# EAGLE design SAML10_DEV (EAGLE 9.5.1)
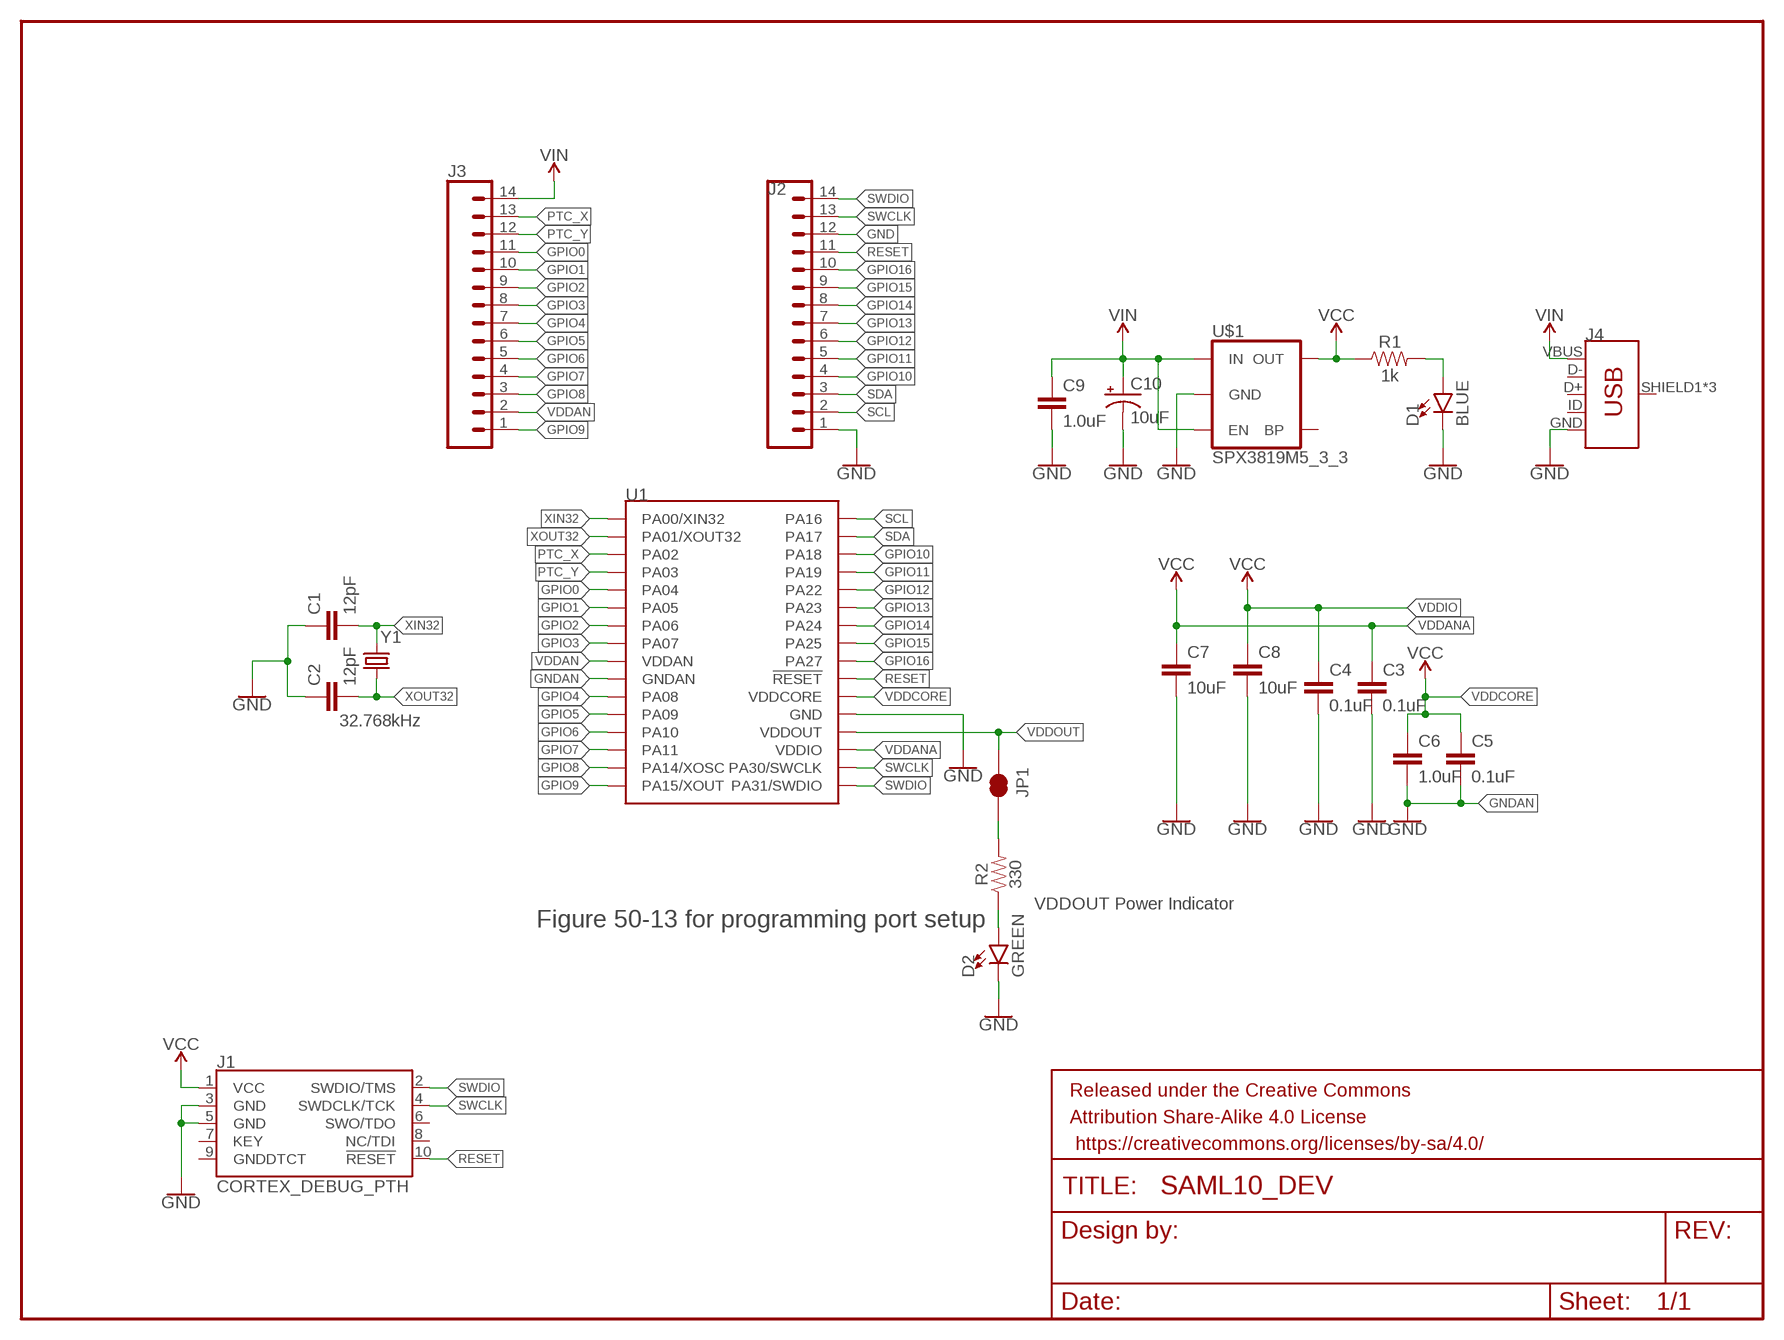
[diagram p0: schematic, sheet 1]

## Parts
C1  12pF  12PF-0603-50V-5%  [0603]
C2  12pF  12PF-0603-50V-5%  [0603]
C3  0.1uF  0.1UF-0402-16V-10%  [0402]
C4  0.1uF  0.1UF-0402-16V-10%  [0402]
C5  0.1uF  0.1UF-0402-16V-10%  [0402]
C6  1.0uF  1.0UF-0402-16V-10%  [0402]
C7  10uF  10UF-0603-6.3V-20%  [0603]
C8  10uF  10UF-0603-6.3V-20%  [0603]
C9  1.0uF  1.0UF-0402-16V-10%  [0402]
C10  10uF  10UF-POLAR-0603-6.3V-20%(TANT)  [0603-POLAR]
D1  BLUE  LED-BLUE0603  [LED-0603]
D2  GREEN  LED-GREEN0603  [LED-0603]
FRAME1  FRAME-LETTERNO_PACKAGE  [DUMMY]
J1  CORTEX_DEBUG_PTH  [2X5-PTH-1.27MM]
J2  CONN_14  [1X14]
J3  CONN_14  [1X14]
J4  USB_MICRO-BREDUCED_PASTE  [USB-B-MICRO-SMD_RED_PASTE]
JP1  JUMPER-SMT_2_NC_TRACE_NO-SILK  [SMT-JUMPER_2_NC_TRACE_NO-SILK]
R1  1k  1KOHM-0603-1/10W-1%  [0603]
R2  330  330OHM-0603-1/10W-1%  [0603]
U1  SAML10  [ATSAML10E15A-MU-ND]
U$1  SPX3819M5_3_3  V_REG_SPX3819-SOT23-5  [SOT23-5]
Y1  32.768kHz  CRYSTAL-32.768KHZSMD-3.2X1.5  [CRYSTAL-SMD-3.2X1.5MM]

## Nets
GND: C1.1 C2.1 C3.2 C4.2 C7.2 C8.2 C9.2 C10.- D1.C D2.C J1.3(GND) J1.5(GND) J2.1 J2.12 J4.GND U1.P$28(GND) U$1.2(GND)
GNDAN: C5.2 C6.2 U1.P$10(GNDAN) ; supply symbol labelled GND
GPIO0: J3.11 U1.P$5(PA04)
GPIO1: J3.10 U1.P$6(PA05)
GPIO2: J3.9 U1.P$7(PA06)
GPIO3: J3.8 U1.P$8(PA07)
GPIO4: J3.7 U1.P$11(PA08)
GPIO5: J3.6 U1.P$12(PA09)
GPIO6: J3.5 U1.P$13(PA10)
GPIO7: J3.4 U1.P$14(PA11)
GPIO8: J3.3 U1.P$15(PA14/XOSC)
GPIO9: J3.1 U1.P$16(PA15/XOUT)
GPIO10: J2.4 U1.P$19(PA18)
GPIO11: J2.5 U1.P$20(PA19)
GPIO12: J2.6 U1.P$21(PA22)
GPIO13: J2.7 U1.P$22(PA23)
GPIO14: J2.8 U1.P$23(PA24)
GPIO15: J2.9 U1.P$24(PA25)
GPIO16: J2.10 U1.P$25(PA27)
N$1: JP1.2 R2.2
N$2: D2.A R2.1
N$25: D1.A R1.2
PTC_X: J3.13 U1.P$3(PA02)
PTC_Y: J3.12 U1.P$4(PA03)
RESET: J1.10(!RESET) J2.11 U1.P$26(!RESET)
SCL: J2.2 U1.P$17(PA16)
SDA: J2.3 U1.P$18(PA17)
SWCLK: J1.4(SWDCLK/TCK) J2.13 U1.P$31(PA30/SWCLK)
SWDIO: J1.2(SWDIO/TMS) J2.14 U1.P$32(PA31/SWDIO)
VCC: J1.1(VCC) R1.1 U$1.5(OUT)
VDDAN: J3.2 U1.P$9(VDDAN)
VDDANA: C3.1 C7.1 U1.P$30(VDDIO) ; supply symbol labelled VCC
VDDCORE: C5.1 C6.1 U1.P$27(VDDCORE) ; supply symbol labelled VCC
VDDIO: C4.1 C8.1 ; supply symbol labelled VCC
VDDOUT: JP1.1 U1.P$29(VDDOUT)
VIN: C9.1 C10.+ J3.14 J4.VBUS U$1.1(IN) U$1.3(EN)
XIN32: C1.2 U1.P$1(PA00/XIN32) Y1.P$1
XOUT32: C2.2 U1.P$2(PA01/XOUT32) Y1.P$2
Unconnected: J1.6(SWO/TDO) J1.7(KEY) J1.8(NC/TDI) J1.9(GNDDTCT) J4.D+ J4.D- J4.ID J4.SHIELD1(SHIELD) J4.SHIELD2(SHIELD) J4.SHIELD3(SHIELD) U$1.4(BP)

## Notes on the sheet
- VDDOUT Power Indicator
- Figure 50-13 for programming port setup

## Library data of the parts
C1 C2 = SparkFun-Capacitors:12PF: 12pF ceramic capacitors A capacitor is a passive two-terminal electrical component used to store electrical energy temporarily in an electric field.; PROD_ID: CAP-09137
C3-C5 = SparkFun-Capacitors:0.1UF: 0.1µF ceramic capacitors A capacitor is a passive two-terminal electrical component used to store electrical energy temporarily in an electric field.; PROD_ID: CAP-12416
C6 C9 = SparkFun-Capacitors:1.0UF: 1µF ceramic capacitors A capacitor is a passive two-terminal electrical component used to store electrical energy temporarily in an electric field.; PROD_ID: CAP-12417
C7 C8 = SparkFun-Capacitors:10UF: 10.0µF ceramic capacitors A capacitor is a passive two-terminal electrical component used to store electrical energy temporarily in an electric field.; PROD_ID: CAP-11015
C10 = SparkFun-Capacitors:10UF-POLAR: 10.0µF polarized capacitors A capacitor is a passive two-terminal electrical component used to store electrical energy temporarily in an electric field.; PROD_ID: CAP-13210
D1 = SparkFun-LED:LED-BLUE: Blue SMD LED Used in manufacturing of various products at SparkFun Packages: 0603 - SMD 0603 package [Product Link] <http://www.digikey.com/product-detail/en/SMLE12BC7TT86/511-1589-2-ND/1641808> 1206 - SMD1206 package [Product Link] <http://www.digikey.com/product-detail/en/lite-on-inc/LTST-C150TBKT/160-1643-1-ND/573584> SparkFun Products: ESP8266 Thing-Dev Board <https://www.sparkfun.com/products/13711> RedBoard <https://www.sparkfun.com/products/12757>; PROD_ID: DIO-08575
D2 = SparkFun-LED:LED-GREEN: Green SMD LED Used in manufacturing of various products at SparkFun Packages: 0603 - SMD 0603 package [Product Link] <http://www.futureelectronics.com/en/technologies/semiconductors/optoelectronics/leds/Pages/9894312-LTST-C190GKT.aspx?CrossPart=HSMG-C190&IM=0> LilyPad 1206 - SMD1206 LilyPad package [Product Link] <http://www.futureelectronics.com/en/Technologies/Product.aspx?ProductID=IN150NGHARVATEKCORPORATION2049943&IM=0> 1206 - SMD1206 package [Product Link] <http://www.futureelectronics.com/en/technologies/semiconductors/optoelectronics/leds/Pages/8315665-LTST-C150KGKT.aspx?IM=0> 1206 Bottom Mount -SMD 1206 Bottom Mount [Product Link] <http://www.digikey.com/product-detail/en/lite-on-inc/LTST-C230KGKT/160-1456-1-ND/386854> SparkFun Products: Pro Mini 328 -5V <https://www.sparkfun.com/products/821> RedBoard <https://www.sparkfun.com/products/12757> MP3 Trigger <https://www.sparkfun.com/products/13720> Makey Makey <https://www.sparkfun.com/products/11076>; PROD_ID: DIO-00821
FRAME1 = SparkFun-Aesthetics:FRAME-LETTER: Schematic Frame - Letter Standard 8.5x11 US Letter frame; DESIGNER: Nobody; VERSION: v01
J1 = SparkFun-Connectors:CORTEX_DEBUG: Cortex Debug Connector - 10 pin Supports JTAG debug, Serial Wire debug, and Serial Wire Viewer. PTH and SMD connector options available. General Connector Information <http://infocenter.arm.com/help/topic/com.arm.doc.faqs/attached/13634/cortex_debug_connectors.pdf> Products: PTH Connector <http://www.digikey.com/product-detail/en/cnc-tech/3220-10-0100-00/1175-1627-ND/3883661> -via Digi-Key SparkFun PSoc <https://www.sparkfun.com/products/13229> SparkFun T <https://www.sparkfun.com/products/13810>
J2 J3 = SparkFun-Connectors:CONN_14: Multi connection point. Often used as Generic Header-pin footprint for 0.1 inch spaced/style header connections On any of the 0.1 inch spaced packages, you can populate with these: Break Away Headers - Straight <https://www.sparkfun.com/products/116> (PRT-00116) Break Away Male Headers - Right Angle <https://www.sparkfun.com/products/553> (PRT-00553) Female Headers <https://www.sparkfun.com/products/115> (PRT-00115) Break Away Headers - Machine Pin <https://www.sparkfun.com/products/117> (PRT-00117) Break Away Female Headers - Swiss Machine Pin <https://www.sparkfun.com/products/743> (PRT-00743) For SCREWTERMINALS and SPRING TERMINALS visit here: Screw Terimnals on SparkFun.com <https://www.sparkfun.com/search/results?term=Screw+Terminals> (5mm/3.5mm/2.54mm spacing) This device is also useful as a general connection point to wire up your design to another part of your project. Our various solder wires solder well into these plated through hole pads. Hook-Up Wire - Assortment (Stranded, 22 AWG) <https://www.sparkfun.com/products/11375> (PRT-11375) Hook-Up Wire - Assortment (Solid Core, 22 AWG) <https://www.sparkfun.com/products/11367> (PRT-11367) View the entire wire category on our website here <https://www.sparkfun.com/categories/141> Special notes: Molex polarized connector foot print use with SKU : PRT-08231 with associated crimp pins and housings. 1MM SMD Version SKU: PRT-10208 NOTES ON THE VARIANTS LOCK and LOCK_LONGPADS... This footprint was designed to help hold the alignment of a through-hole component (i.e. 6-pin header) while soldering it into place. You may notice that each hole has been shifted either up or down by 0.005 of an inch from it's more standard position (which is a perfectly straight line). This slight alteration caused the pins (the squares in the middle) to touch the edges of the holes. Because they are alternating, it causes a "brace" to hold the component in place. 0.005 has proven to be the perfect amount of "off-center" position when using our standard breakaway headers. Although looks a little odd when you look at the bare footprint, once you have a header in there, the alteration is very hard to notice. Also,if you push a header all the way into place, it is covered up entirely on the bottom side.
J4 = SparkFun-Connectors:USB_MICRO-B: USB Type Micro-B Connector Male/female and PTH/SMT variants SparkFun Products: SparkFun microB USB Breakout <https://www.sparkfun.com/products/12035> SparkFun USB microB Plug Breakout <https://www.sparkfun.com/products/10031> SparkFun ESP8266 Thing <https://www.sparkfun.com/products/13231>; PROD_ID: CONN-11752
JP1 = SparkFun-Jumpers:JUMPER-SMT_2_NC_TRACE: Normally closed trace jumper This jumper has a trace between two pads so it's normally closed (NC). Use a razor knife to open the connection. For best results follow the IPC guidelines for cutting traces: Cutout at least 0.063 mm (0.005 in). Remove all loose material to clean up the cut area. Seal the cut with an approved epoxy. Reapply solder to reclose the connection.
R1 = SparkFun-Resistors:1KOHM: 1kΩ resistor A resistor is a passive two-terminal electrical component that implements electrical resistance as a circuit element. Resistors act to reduce current flow, and, at the same time, act to lower voltage levels within circuits. - Wikipedia; PROD_ID: RES-07856
R2 = SparkFun-Resistors:330OHM: 330Ω resistor A resistor is a passive two-terminal electrical component that implements electrical resistance as a circuit element. Resistors act to reduce current flow, and, at the same time, act to lower voltage levels within circuits. - Wikipedia; PROD_ID: RES-00818
U1 = ARM_Cortex_23:SAML10
U$1 = SparkFun-IC-Power:V_REG_SPX3819: SPX3819 Voltage Regulator 3.3V 500mA, 16V input Datasheet <https://www.exar.com/content/document.ashx?id=22106> SparkFun Products: SparkFun Serial Controlled Motor Driver <https://www.sparkfun.com/products/13911>; PROD_ID: VREG-13321
Y1 = SparkFun-Clocks:CRYSTAL-32.768KHZ: 32.768kHz Crystal Frequency: 32.768kHz Frequency Stability: ±20ppm Load Capacitance: 12.5pF (PTH-2X6 & SMD-3.2X1.5), 6pF (SMD-2X6) SparkFun Products: SparkFun BigTime Watch Kit <https://www.sparkfun.com/products/11734> SparkFun nRF52832 Breakout <https://www.sparkfun.com/products/13990> SparkFun Real Time Clock Module <https://www.sparkfun.com/products/12708>; PROD_ID: XTAL-13062

## Board
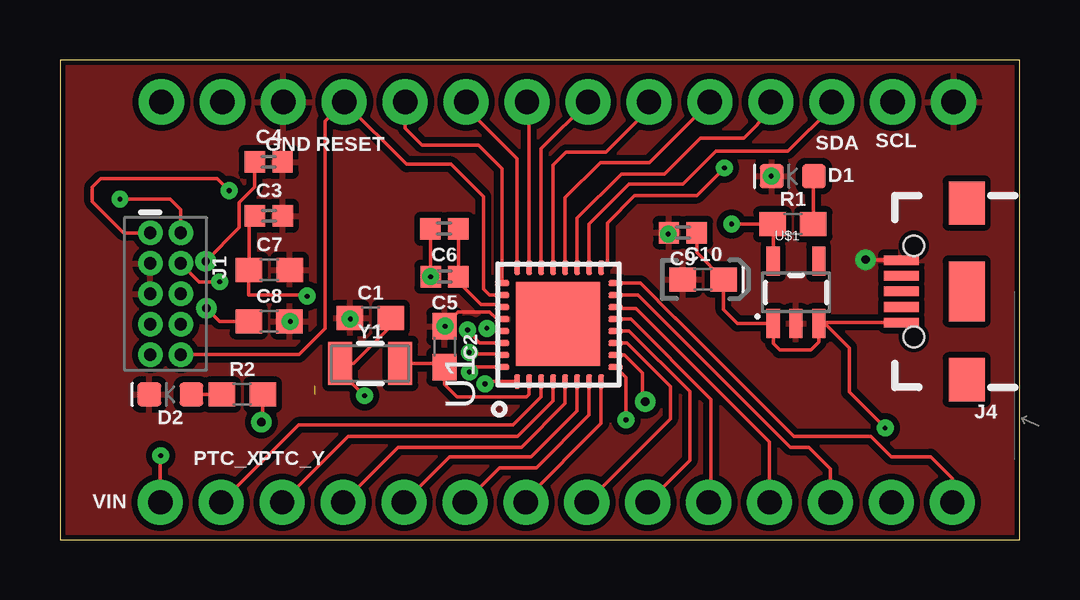
[diagram p1: board, top side]
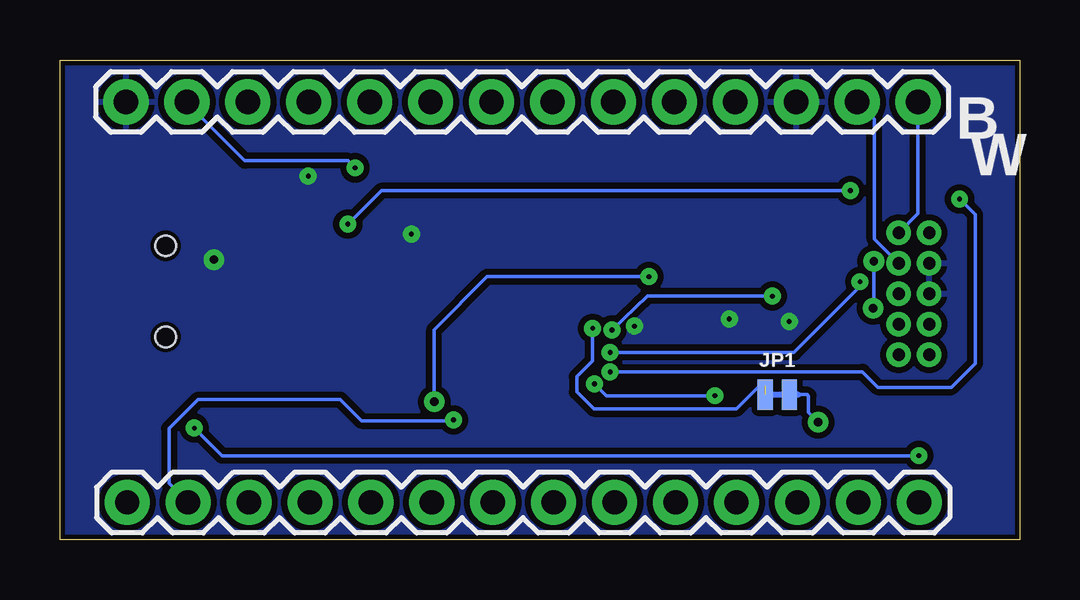
[diagram p2: board, bottom side, seen from below]

Size 40 x 20 mm. Coordinates in mm from the lower left corner, seen from the top.
Outline: 0,0 40,0 40,20 0,20 0,0
Copper layers (1*16): Top 0.035mm / dielectric 1.5mm / Bottom 0.035mm
Design rules "SparkFun-2-layer-STANDARD": minimum track width 10mil, minimum drill 20mil, track to track 10mil, track to pad 8mil, pad to pad 8mil, via to via 10mil, smd to smd 8mil, copper to edge 8mil, drill to drill 8mil, minimum pad ring 10mil, minimum via ring 10mil, stop-mask expansion 4mil, vias tented up to drill 25mil, thermal gap 10mil

### Footprints (pad centres in the part's own frame; a part is rotated, then mirrored left to right if it is on the bottom)
0603 = smd 1.1 x 1: 1 -0.85,0; 2 0.85,0
0402 = smd 0.85 x 0.9: 1 -0.58,0; 2 0.58,0
0603-POLAR = smd 1.1 x 1: + 0.85,0; - -0.85,0
LED-0603 = smd 1 x 1: A -0.877,0; C 0.877,0
2X5-PTH-1.27MM = drill 0.508 pad 1: 1 -2.54,-0.635; 2 -2.54,0.635; 3 -1.27,-0.635; 4 -1.27,0.635; 5 0,-0.635; 6 0,0.635; 7 1.27,-0.635; 8 1.27,0.635; 9 2.54,-0.635; 10 2.54,0.635
1X14 = drill 1.016 pad 1.88: 1 0,0; 2 2.54,0; 3 5.08,0; 4 7.62,0; 5 10.16,0; 6 12.7,0; 7 15.24,0; 8 17.78,0; 9 20.32,0; 10 22.86,0; 11 25.4,0; 12 27.94,0; 13 30.48,0; 14 33.02,0
USB-B-MICRO-SMD_RED_PASTE = smd 1.45 x 0.4: D+ 2.725,0; D- 2.725,0.65; GND 2.725,-1.3; ID 2.725,-0.65; VBUS 2.725,1.3 | smd 1.5 x 1.8: SHIELD1 0,3.685; SHIELD2 0,-3.685 | smd 1.5 x 2.5: SHIELD3 0,0 | hole 0.85: 2.2,1.9; 2.2,-1.9
SMT-JUMPER_2_NC_TRACE_NO-SILK = smd 0.635 x 1.27: 1 -0.508,0; 2 0.508,0
ATSAML10E15A-MU-ND = smd 0.6 x 0.25: P$1 0.15,4.25; P$2 0.15,3.75; P$3 0.15,3.25; P$4 0.15,2.75; P$5 0.15,2.25; P$6 0.15,1.75; P$7 0.15,1.25; P$8 0.15,0.75; P$17 4.9,0.75; P$18 4.9,1.25; P$19 4.9,1.75; P$20 4.9,2.25; P$21 4.9,2.75; P$22 4.9,3.25; P$23 4.9,3.75; P$24 4.9,4.25 | smd 0.25 x 0.6: P$9 0.75,0.15; P$10 1.25,0.15; P$11 1.75,0.15; P$12 2.25,0.15; P$13 2.75,0.15; P$14 3.25,0.15; P$15 3.75,0.15; P$16 4.25,0.15; P$25 4.25,4.88; P$26 3.75,4.88; P$27 3.25,4.88; P$28 2.75,4.88; P$29 2.25,4.88; P$30 1.75,4.88; P$31 1.25,4.88; P$32 0.75,4.88 | smd 3.5 x 3.5: P$33 2.54,2.54
SOT23-5 = smd 0.55 x 1.2: 1 -0.95,-1.3; 2 0,-1.3; 3 0.95,-1.3; 4 0.95,1.3; 5 -0.95,1.3
CRYSTAL-SMD-3.2X1.5MM = smd 1 x 1.8: P$1 -1.25,0; P$2 1.25,0

### Placement (x,y rotation side)
C1  12.94,9.24 0 top
C2  16.03,8.04 270 top
C3  8.71,13.5 0 top
C4  8.7,15.75 0 top
C5  16.03,10.96 180 top
C6  16.02,12.96 180 top
C7  8.73,11.25 0 top
C8  8.72,9.1 0 top
C9  25.96,12.8 180 top
C10  26.81,10.85 0 top
D1  30.55,15.15 180 top
D2  4.6,6.05 180 top
FRAME1  0.02,0.01 0 top
J1  4.4,10.25 270 top
J2  37.25,18.25 0 bottom
J3  37.2,1.55 0 bottom
J4  37.8,10.35 180 top
JP1  10.1,6.05 0 bottom
R1  30.55,13.15 0 top
R2  7.6,6.05 0 top
U1  23.31,6.44 90 top
U$1  30.68,10.31 0 top
Y1  12.93,7.34 0 top

### Tracks (layer width: path | path; a pad name or v marks a point on that pad's centre or on a via)
GND  (via drill 0.2, 0.35)
  Top 0.152: J4.GND 33.65,11.65 33.6,11.7 v33.58,11.68 | v16.05,8.9 16.05,8.95 16.59,9.49 17.91,9.49 18.21,9.19 U1.P$28
  other vias: 29.65,15.15 25.35,12.74 9.6,9.1 12.1,9.2
  pour Top: 0,20 0,0 40,0 40,20
  pour Bottom: 0,20 0,0 40,0 40,20
GNDAN  (via drill 0.2, 0.35)
  Top 0.152: C6.2 C5.2 | U1.P$10 23.54,7.69 24.27,6.95 24.27,5.87 v24.4,5.74
  Bottom 0.152: v24.4,5.74 24.4,8.75 22.19,10.96 C5.2
  other vias: 15.45,10.96
GPIO0
  Top 0.152: U1.P$5 21.06,5.67 19.24,3.85 14.1,3.85 J3.11
GPIO1
  Top 0.152: U1.P$6 21.56,5.37 19.64,3.45 16.24,3.45 J3.10
GPIO2
  Top 0.152: U1.P$7 22.06,5.2 19.86,3 18.33,3 J3.9
GPIO3
  Top 0.152: U1.P$8 22.56,4.85 19.42,1.71 J3.8
GPIO4
  Top 0.152: U1.P$11 23.65,8.19 25.45,6.39 25.45,5.04 J3.7
GPIO5
  Top 0.152: U1.P$12 23.73,8.69 26.25,6.17 26.25,3.3 J3.6
GPIO6
  Top 0.152: J3.5 27.14,1.65 27.14,5.85 23.8,9.19 U1.P$13
GPIO7
  Top 0.152: J3.4 29.58,4.07 24.02,9.63 23.22,9.63 U1.P$14
GPIO8
  Top 0.152: U1.P$15 24.1,10.19 30.45,3.85 31.23,3.85 32.12,2.95 J3.3
GPIO9
  Top 0.152: U1.P$16 24.19,10.69 25.66,9.22 25.66,9.24 30.6,4.3 33.8,4.3 34.65,3.45 36.3,3.45 37.2,2.55 J3.1
GPIO10
  Top 0.152: U1.P$19 21.56,13.4 23.41,15.25 25.2,15.25 26.7,16.75 28.5,16.75 29.63,17.88 J2.4
GPIO11
  Top 0.152: U1.P$20 21.06,14.26 22.53,15.73 24.57,15.73 J2.5
GPIO12
  Top 0.152: U1.P$21 20.56,15.61 21.1,16.15 22.75,16.15 24.55,17.95 J2.6
GPIO13
  Top 0.152: U1.P$22 20.06,16.3 J2.7
GPIO14
  Top 0.152: U1.P$23 19.56,18.16 J2.8
GPIO15
  Top 0.152: U1.P$24 19.06,15.89 16.93,18.02 J2.9
GPIO16
  Top 0.152: U1.P$25 18.43,15.47 17.45,16.45 15.1,16.45 14.39,17.16 J2.10
N$1  (via drill 0.35)
  Top 0.152: R2.2 8.45,4.95 v8.4,4.9
  Bottom 0.152: v8.4,4.9 8.8,5.3 8.8,6 8.85,6.05 9.24,6.05
  Bottom 0.254: 9.24,6.05 JP1.2
N$2
  Top 0.152: D2.A R2.1
N$25
  Top 0.152: R1.2 31.4,15.12 D1.A
PTC_X
  Top 0.152: U1.P$3 20.06,5.95 18.89,4.78 9.95,4.78 J3.13
PTC_Y
  Top 0.152: U1.P$4 20.56,5.78 19.08,4.3 12.01,4.3 J3.12
RESET
  Top 0.152: U1.P$26 17.9,10.2 17.65,10.45 17.65,14.3 16.3,15.65 14.45,15.65 J2.11 11.05,17.45 11.05,8.8 9.96,7.71 J1.10
SCL  (via drill 0.2)
  Top 0.152: U1.P$17 22.81,11.59 22.81,13.2 23.96,14.35 26.55,14.35 v27.7,15.5
  Bottom 0.152: v27.7,15.5 28,15.8 32.3,15.8 34.71,18.21 J2.2
SDA
  Top 0.152: U1.P$18 22.06,13.15 23.73,14.82 25.2,14.82 25.97,14.82 27.35,16.2 30.35,16.2 32.17,18.02 J2.3
SWCLK  (via drill 0.2)
  Top 0.152: J1.4 5.8,10.75 v6.65,10.75 | U1.P$31 18.39,7.73 17.35,7.73 17.29,7.8 v17.06,7.8
  Bottom 0.152: J1.4 6.05,12.54 6.05,17.53 J2.13 | v6.65,10.75 6.65,10.55 9.4,7.8 v17.06,7.8
SWDIO  (via drill 0.2)
  Top 0.152: v2.5,14.2 4.6,14.2 5.04,13.77 J1.2 | U1.P$32 17.06,7.19 v17.06,6.99
  Bottom 0.152: J1.2 4.23,13.6 J2.14 | v17.06,6.99 6.54,6.99 5.9,6.35 2.85,6.35 1.85,7.35 1.85,13.55 v2.5,14.2
VCC  (via drill 0.2)
  Top 0.152: U$1.5 29.73,13.12 R1.1 v28,13.15 | J1.1 2.66,12.79 1.35,14.1 1.35,14.7 1.7,15.05 6.55,15.05 v7.05,14.55
  Bottom 0.152: v7.05,14.55 26.6,14.55 v28,13.15
VDDAN  (via drill 0.2)
  Top 0.152: U1.P$9 23.59,6.76 v23.59,4.99
  Bottom 0.152: v23.59,4.99 | J3.2 35.45,2.34 35.45,4.63 34.26,5.82 34.23,5.84 28.32,5.84 27.43,4.95 23.62,4.95
  Bottom 0.254: 23.62,4.95 v23.59,4.99
VDDANA  (via drill 0.2)
  Top 0.152: C3.1 7.88,13.25 C7.1 7.87,10.2 10.25,10.2 v10.3,10.15 | v16.98,8.74 17.48,8.19 U1.P$30
  Bottom 0.152: v10.3,10.15 15.52,10.15 v16.98,8.74
VDDCORE
  Top 0.152: U1.P$27 18.32,9.8 17.55,9.8 16.61,10.74 | C6.1 C5.1
  Top 0.254: C5.1 16.61,10.74
VDDIO  (via drill 0.35)
  Top 0.152: C8.1 6.65,9.1 v6.1,9.65 | v6.07,11.6 7.48,13 7.48,14.04 8.12,14.69 C4.1
  Bottom 0.152: v6.1,9.65 6.07,9.68 v6.07,11.6
VDDOUT  (via drill 0.2 pad 0.35)  (1 unrouted)
  Top 0.152: U1.P$29 17.81,8.69 v17.79,8.81
  Bottom 0.152: v17.79,8.81 17.8,7.45 18.45,6.8 18.45,6.15 17.75,5.45 11.8,5.45 10.84,6.41 10.61,6.41
VIN  (via drill 0.2)
  Top 0.152: J3.14 4.18,3.48 v4.2,3.5 | v34.4,4.65 32.9,6.15 32.9,8 31.89,9.01 U$1.3 | J4.VBUS 31.67,9.05 U$1.3 | U$1.3 31.63,8.23 31.3,7.9 30,7.9 29.73,8.17 U$1.1 28.24,9.01 27.66,9.59 C10.+ 26.54,11.96 C9.1
  Bottom 0.152: v4.2,3.5 33.25,3.5 v34.4,4.65
XIN32  (via drill 0.2)
  Top 0.152: U1.P$1 17.81,6.59 v17.71,6.49 | v12.7,6 11.68,7.02 Y1.P$1 12.24,7.34 13.79,8.89 C1.2
  Bottom 0.152: v17.71,6.49 17.22,6 v12.7,6
XOUT32
  Top 0.152: U1.P$2 19.56,6.06 19.45,5.95 16.55,5.95 16.03,6.47 C2.2 15.88,7.34 Y1.P$2

### Text on the board
tPlace: GND | RESET | SDA | SCL | PTC_X | PTC_Y | VIN
bPlace: B | W